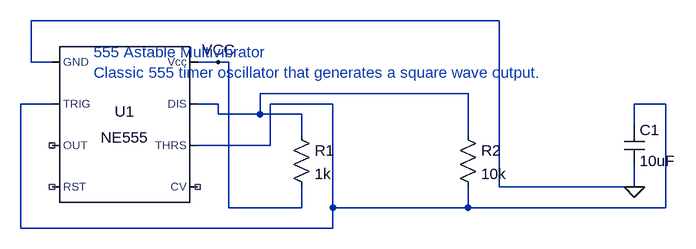
[diagram p0: schematic 555_astable_multivibrator.asc]
555_astable_multivibrator.asc, the LTspice schematic file:
Version 4
SHEET 1 1200 800
TEXT 16 16 Left 2 ;555 Astable Multivibrator
TEXT 16 48 Left 2 ;Classic 555 timer oscillator that generates a square wave output.
SYMBOL Misc\NE555 64 128 R0
SYMATTR InstName U1
SYMATTR Value NE555
SYMBOL res 320 128 R0
SYMATTR InstName R1
SYMATTR Value 1k
SYMBOL res 576 128 R0
SYMATTR InstName R2
SYMATTR Value 10k
SYMBOL cap 832 128 R0
SYMATTR InstName C1
SYMATTR Value 10uF
FLAG 208 32 VCC
WIRE 176 32 208 32
WIRE 208 32 224 32
WIRE 224 32 224 256
WIRE 224 256 336 256
WIRE 336 224 336 256
FLAG 848 224 0
WIRE -80 -32 -80 32
WIRE -80 -32 640 -32
WIRE -80 32 -48 32
WIRE 640 -32 640 224
WIRE 640 224 848 224
WIRE 848 192 848 224
WIRE -96 96 -96 288
WIRE -96 96 -80 96
WIRE -96 288 384 288
WIRE -80 96 -48 96
WIRE 176 160 208 160
WIRE 208 160 288 160
WIRE 288 96 288 160
WIRE 288 96 384 96
WIRE 384 96 384 256
WIRE 384 256 384 288
WIRE 384 256 592 256
WIRE 592 224 592 256
WIRE 592 256 896 256
WIRE 848 96 848 128
WIRE 848 96 896 96
WIRE 896 96 896 256
WIRE 176 96 208 96
WIRE 208 96 208 112
WIRE 208 112 272 112
WIRE 272 80 272 112
WIRE 272 80 592 80
WIRE 272 112 336 112
WIRE 336 112 336 144
WIRE 592 80 592 112
WIRE 592 112 592 144

The netlist it stands for:
* 555_astable_multivibrator.asc
XU1 0 N001 NC_01 NC_02 NC_03 N001 N002 VCC NE555  ; pins GND TRIG OUT RST CV THRS DIS Vcc
R1 N002 VCC 1k
R2 N002 N001 10k
C1 N001 0 10uF
* 555 Astable Multivibrator
* Classic 555 timer oscillator that generates a square wave output.
.lib NE555.sub
.backanno
.end